# Altium schematic sheet Mechanical.SchDoc: =DocumentName
size A4; DocumentNumber: 1; Revision: 0; SheetNumber: 19; SheetTotal: 19; Last modified by: Krzysztof Belewicz
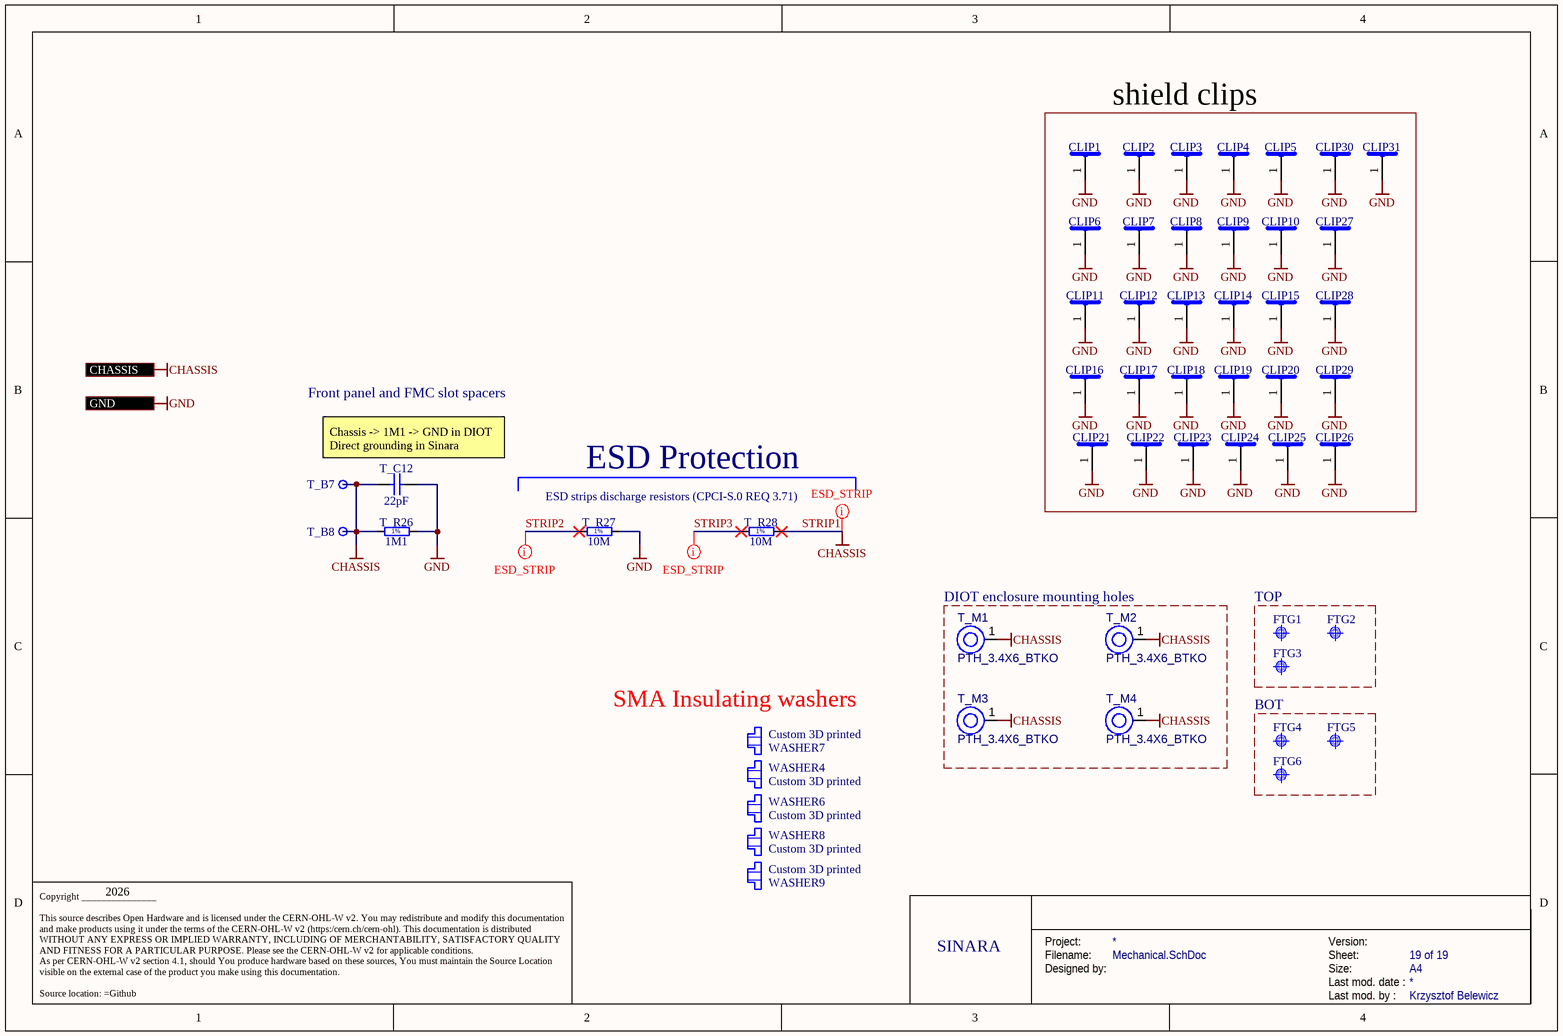
[diagram p0: Mechanical.SchDoc]

## Parts
CLIP1  S1411-46R  [CLIP_HOLLAND-SHIELDING_LC]  (value not drawn)
CLIP2  S1411-46R  [CLIP_HOLLAND-SHIELDING_LC]  (value not drawn)
CLIP3  S1411-46R  [CLIP_HOLLAND-SHIELDING_LC]  (value not drawn)
CLIP4  S1411-46R  [CLIP_HOLLAND-SHIELDING_LC]  (value not drawn)
CLIP5  S1411-46R  [CLIP_HOLLAND-SHIELDING_LC]  (value not drawn)
CLIP6  S1411-46R  [CLIP_HOLLAND-SHIELDING_LC]  (value not drawn)
CLIP7  S1411-46R  [CLIP_HOLLAND-SHIELDING_LC]  (value not drawn)
CLIP8  S1411-46R  [CLIP_HOLLAND-SHIELDING_LC]  (value not drawn)
CLIP9  S1411-46R  [CLIP_HOLLAND-SHIELDING_LC]  (value not drawn)
CLIP10  S1411-46R  [CLIP_HOLLAND-SHIELDING_LC]  (value not drawn)
CLIP11  S1411-46R  [CLIP_HOLLAND-SHIELDING_LC]  (value not drawn)
CLIP12  S1411-46R  [CLIP_HOLLAND-SHIELDING_LC]  (value not drawn)
CLIP13  S1411-46R  [CLIP_HOLLAND-SHIELDING_LC]  (value not drawn)
CLIP14  S1411-46R  [CLIP_HOLLAND-SHIELDING_LC]  (value not drawn)
CLIP15  S1411-46R  [CLIP_HOLLAND-SHIELDING_LC]  (value not drawn)
CLIP16  S1411-46R  [CLIP_HOLLAND-SHIELDING_LC]  (value not drawn)
CLIP17  S1411-46R  [CLIP_HOLLAND-SHIELDING_LC]  (value not drawn)
CLIP18  S1411-46R  [CLIP_HOLLAND-SHIELDING_LC]  (value not drawn)
CLIP19  S1411-46R  [CLIP_HOLLAND-SHIELDING_LC]  (value not drawn)
CLIP20  S1411-46R  [CLIP_HOLLAND-SHIELDING_LC]  (value not drawn)
CLIP21  S1411-46R  [CLIP_HOLLAND-SHIELDING_LC]  (value not drawn)
CLIP22  S1411-46R  [CLIP_HOLLAND-SHIELDING_LC]  (value not drawn)
CLIP23  S1411-46R  [CLIP_HOLLAND-SHIELDING_LC]  (value not drawn)
CLIP24  S1411-46R  [CLIP_HOLLAND-SHIELDING_LC]  (value not drawn)
CLIP25  S1411-46R  [CLIP_HOLLAND-SHIELDING_LC]  (value not drawn)
CLIP26  S1411-46R  [CLIP_HOLLAND-SHIELDING_LC]  (value not drawn)
CLIP27  S1411-46R  [CLIP_HOLLAND-SHIELDING_LC]  (value not drawn)
CLIP28  S1411-46R  [CLIP_HOLLAND-SHIELDING_LC]  (value not drawn)
CLIP29  S1411-46R  [CLIP_HOLLAND-SHIELDING_LC]  (value not drawn)
CLIP30  S1411-46R  [CLIP_HOLLAND-SHIELDING_LC]  (value not drawn)
CLIP31  S1411-46R  [CLIP_HOLLAND-SHIELDING_LC]  (value not drawn)
FTG1  Use only in PCB  [FIDUCIAL_TOP_C100-200]  (value not drawn)  (no BOM)
FTG2  Use only in PCB  [FIDUCIAL_TOP_S100-200]  (value not drawn)  (no BOM)
FTG3  Use only in PCB  [FIDUCIAL_TOP_S100-200]  (value not drawn)  (no BOM)
FTG4  Use only in PCB  [FIDUCIAL_TOP_C100-200]  (value not drawn)  (no BOM)
FTG5  Use only in PCB  [FIDUCIAL_TOP_S100-200]  (value not drawn)  (no BOM)
FTG6  Use only in PCB  [FIDUCIAL_TOP_S100-200]  (value not drawn)  (no BOM)
T_B7  Plated Hole  [c600h270]  (value not drawn)  (no BOM)
T_B8  Plated Hole  [c600h270]  (value not drawn)  (no BOM)
T_C12  22pF  [CAPC1005X55N]
T_M1  PTH_3.4X6_BTKO  [PTH-M3.4x6.0_BTKO]  (no BOM)
T_M2  PTH_3.4X6_BTKO  [PTH-M3.4x6.0_BTKO]  (no BOM)
T_M3  PTH_3.4X6_BTKO  [PTH-M3.4x6.0_BTKO]  (no BOM)
T_M4  PTH_3.4X6_BTKO  [PTH-M3.4x6.0_BTKO]  (no BOM)
T_R26  1M1  [RESC2012X60N]
T_R27  10M  [RESC2113X55N]
T_R28  10M  [RESC2113X55N]
WASHER4  Custom 3D printed  [Keystone_7687]
WASHER6  Custom 3D printed  [Keystone_7687]
WASHER7  Custom 3D printed  [Keystone_7687]
WASHER8  Custom 3D printed  [Keystone_7687]
WASHER9  Custom 3D printed  [Keystone_7687]

## Blocks framed on the sheet
shield clips: CLIP1-CLIP31
DIOT enclosure mounting holes: T_M1-T_M4
TOP: FTG1-FTG3
BOT: FTG4-FTG6

## Ports
CHASSIS, GND

## Nets
GND: CLIP1.1 CLIP2.1 CLIP3.1 CLIP4.1 CLIP5.1 CLIP6.1 CLIP7.1 CLIP8.1 CLIP9.1 CLIP10.1 CLIP11.1 CLIP12.1 CLIP13.1 CLIP14.1 CLIP15.1 CLIP16.1 CLIP17.1 CLIP18.1 CLIP19.1 CLIP20.1 CLIP21.1 CLIP22.1 CLIP23.1 CLIP24.1 CLIP25.1 CLIP26.1 CLIP27.1 CLIP28.1 CLIP29.1 CLIP30.1 CLIP31.1 T_C12.2 T_R26.2 T_R27.2 ; port GND
STRIP1: T_B7.1 T_B8.1 T_C12.1 T_M1.1(H1) T_M2.1(H1) T_M3.1(H1) T_M4.1(H1) T_R26.1 T_R28.2 ; port CHASSIS  [also labelled CHASSIS]
STRIP2: T_R27.1
STRIP3: T_R28.1

## Layout directives
net class ESD_STRIP: STRIP1, STRIP2, STRIP3

## Notes on the sheet
- Front panel and FMC slot spacers
- Chassis -> 1M1 -> GND in DIOT
  Direct grounding in Sinara
- ESD strips discharge resistors (CPCI-S.0 REQ 3.71)
- ESD Protection
- (near WASHER7) SMA Insulating washers
- 2026
- SINARA
- Project:
- Designed by:
- Filename:
- Size:
- Version:
- Last mod. date :
- Sheet:
- A4
- Copyright _______________
  This source describes Open Hardware and is licensed under the CERN-OHL-W v2. You may redistribute and modify this documentation and make products using it under the terms of the CERN-OHL-W v2 (https:/cern.ch/cern-ohl). This documentation is distributed WITHOUT ANY EXPRESS OR IMPLIED WARRANTY, INCLUDING OF MERCHANTABILITY, SATISFACTORY QUALITY AND FITNESS FOR A PARTICULAR PURPOSE. Please see the CERN-OHL-W v2 for applicable conditions.
  As per CERN-OHL-W v2 section 4.1, should You produce hardware based on these sources, You must maintain the Source Location visible on the external case of the product you make using this documentation.
  Source location: =Github
- Last mod. by :
- (in symbol R0805_1M1_1%_0.125W_100PPM) 1%
- (in symbol R0805_10M_1%_0.125W_100PPM_VISHAY_CRCW e3) 1%

## Library data of the parts
CLIP1-CLIP31 = SHIELD_CLIP: Surface Mount Clip for PCB Screening Covers; Part Description: Surface Mount Clip for PCB Screening Covers, 1500 Serie; Manufacturer: HARWIN; PressFit: No; Table: Metal Screening Box; Part Number: S1411-46R; Component Kind: Standard; Component Type: Standard; Pin Count: 1; PackageDescription: Surface Mount Clip for PCB Screening Covers, 1500 Serie; Mounted: Yes; Socket: No; SMD: Yes; Status: None; Manufacturer Part Number: S1411-46R; ComponentHeight: 3.5mm; HelpURL: \\cern.ch\dfs\Applications\Altium\Datasheets\CLIP_HOLLAND-SHIELDING_LC.pdf; Author: CERN DEM JLC; CreateDate: 2013-06-25; LatestRevisionDate: 2013-06-25
FTG1 FTG4 = FIDUCIAL_TARGET_C100-200: Fiducial Target; Part Description: Round Fiducial Target, Top Layer, 1.0mm, Top Solder 2.0mm, Keepout =2.0mm; Mounted: No; Part Number: FIDUCIAL_TARGET_C100-200; Component Type: Standard (No BOM); Pin Count: 1; Family: Fiducial; Socket: No; SMD: Yes; Sense: No; Status: None; ComponentHeight: 0mm; HelpURL: Undefined; Author: CERN DEM JLC; CreateDate: 09.02.2010; LatestRevisionDate: 04.04.2012; PackageDescription: Round Fiducial Target, Top Layer, 1.0mm, Top Solder 2.0mm, Keepout =2.0mm
FTG2 FTG3 FTG5 FTG6 = FIDUCIAL_TARGET_S100-200: Fiducial Target; Part Description: Square Fiducial Target, Top Layer, 1.0mm, Top Solder 2.0mm, Keepout =2.0mm; Mounted: No; Part Number: FIDUCIAL_TARGET_S100-200; Component Type: Standard (No BOM); Pin Count: 1; Family: Fiducial; Socket: No; SMD: Yes; Sense: No; Status: None; ComponentHeight: 0mm; HelpURL: Undefined; Author: CERN DEM JLC; CreateDate: 09.02.2010; LatestRevisionDate: 04.04.2012; PackageDescription: Square Fiducial Target, Top Layer, 1.0mm, Top Solder 2.0mm, Keepout =2.0mm
T_B7 T_B8 = PLATED_HOLE2.7_PAD6.0: Single Terminal Socket; Part Description: Plated Through Hole: Hole Dia.=2.7mm Pad Dia.=6.0mm; Mounted: No; Part Number: PLATED_HOLE2.7_PAD6.0; Component Type: Standard (No BOM); Pin Count: 1; Family: Plated Hole; Socket: No; SMD: No; Sense: No; Status: None; ComponentHeight: 0mm; HelpURL: Undefined; Author: CERN DEM HF; CreateDate: 28.08.2024; LatestRevisionDate: 28.08.2024; PackageDescription: Plated Through Hole: Hole Dia.=2.7mm Pad Dia.=6.0mm
T_C12 = CC0402_22PF_50V_5%_C0G: Non-polarised capacitor; Part Description: SMD Multilayer Chip Ceramic Capacitor; Manufacturer: GENERIC; Manufacturer1 Part Number: C0402C220J5GACTU; Voltage: 50V; TC: C0G/NP0; Tolerance: ±5%; Part Number: CC0402_22PF_50V_5%_C0G; Component Kind: Standard; Component Type: Standard; Pin Count: 2; Value: 22pF; Status: Preferred; Manufacturer Part Number: CC0402_22PF_50V_5%_C0G; Case: 0402; Mounted: Yes; Socket: No; SMD: Yes; Manufacturer1 Example: KEMET; Manufacturer1 ComponentHeight: 0.55mm; HelpURL: \\cern.ch\dfs\Applications\Altium\Datasheets\CC0402_C0G_KEMET_(Commercial Grade).pdf; Author: CERN DEM JLC; CreateDate: 2007-12-03; LatestRevisionDate: 2007-12-03; Sense: No
T_M1-T_M4 = CMP-00028-00019-2: PTH  Hole 3.4, 6mm pad; Pins: 1
T_R26 = R0805_1M1_1%_0.125W_100PPM: Resistor - 1%; Part Description: General Purpose Thick Film Chip Resistor; Manufacturer: GENERIC; Manufacturer1 Part Number: NRC10F1104TRF; PressFit: No; Part Number: R0805_1M1_1%_0.125W_100PPM; Component Kind: Standard; Component Type: Standard; Pin Count: 2; Value: 1M1; Status: Preferred; Manufacturer Part Number: R0805_1M1_1%_0.125W_100PPM; Case: 0805; Mounted: Yes; Sense: No; Socket: No; SMD: Yes; Manufacturer1 Example: NIC COMPONENT; Manufacturer1 ComponentHeight: 0.6mm; HelpURL: \\cern.ch\dfs\Applications\Altium\Datasheets\R0805_NIC_NRC.pdf; Author: CERN DEM JLC; CreateDate: 03/12/2007; LatestRevisionDate: 13/03/2008
T_R27 T_R28 = R0805_10M_1%_0.125W_100PPM_VISHAY_CRCW e3: Resistor - 1%; Part Description: 150V, Standard Thick Film Chip Resistor; Manufacturer: VISHAY DALE; Manufacturer Part Number: CRCW080510M0FKEA; Power: 0.125W; TC: ±100ppm/°C; PressFit: No; Part Number: R0805_10M_1%_0.125W_100PPM_VISHAY_CRCW e3; Component Kind: Standard; Component Type: Standard; Pin Count: 2; Value: 10M; Status: None; Tolerance: ±1%; Case: 0805; Mounted: Yes; Sense: No; Socket: No; SMD: Yes; ComponentHeight: 0.5mm; HelpURL: \\cern.ch\dfs\Applications\Altium\Datasheets\R0805_VISHAY_CRCW e3.pdf; Author: CERN DEM BC; CreateDate: 2019-11-12; LatestRevisionDate: 2019-11-12
WASHER4 WASHER6-WASHER9 = Keystone_7687: SMA_Shoulder Washer; Part Description: Polyphenylene Sulfide PPS Shoulder Washer; PressFit: No; Part Number: Custom 3D printed; Component Kind: Standard; Component Type: Mechanical; Footprint: Custom 3D printed; Pin Count: 0; PackageDescription: Polyphenylene Sulfide PPS Shoulder Washer; Mounted: Yes; Socket: No; SMD: No; Sense: No; Status: None; Value: Custom 3D printed; Manufacturer: Custom 3D printed; Manufacturer Part Number: Custom 3D printed; ComponentHeight: 1.91mm; HelpURL: \\cern.ch\dfs\Applications\Altium\Datasheets\AAVID-THERMALLOY_7721-7PPSG.pdf; Author: GK; CreateDate: 28.01.2016; LatestRevisionDate: 28.01.2016